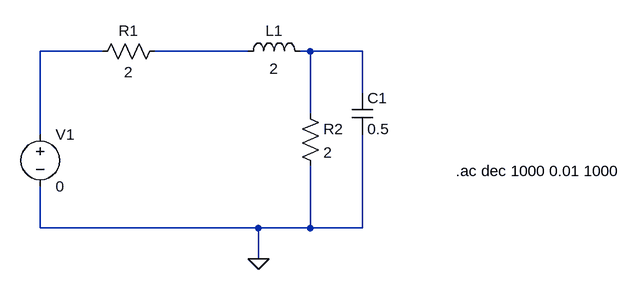
[diagram p0: schematic Part 3- AC Analysis.asc]
Part 3- AC Analysis.asc, the LTspice schematic file:
Version 4
SHEET 1 880 680
WIRE 48 176 -48 176
WIRE 272 176 128 176
WIRE 368 176 352 176
WIRE 448 176 368 176
WIRE 448 240 448 176
WIRE 368 272 368 176
WIRE -48 304 -48 176
WIRE -48 448 -48 384
WIRE 288 448 -48 448
WIRE 368 448 368 352
WIRE 368 448 288 448
WIRE 448 448 448 304
WIRE 448 448 368 448
WIRE 288 496 288 448
FLAG 288 496 0
SYMBOL voltage -48 288 R0
SYMATTR InstName V1
SYMATTR Value 0
SYMATTR Value2 AC 1 0
SYMBOL res 144 160 R90
WINDOW 0 0 56 VBottom 2
WINDOW 3 32 56 VTop 2
SYMATTR InstName R1
SYMATTR Value 2
SYMBOL ind 256 192 R270
WINDOW 0 32 56 VTop 2
WINDOW 3 5 56 VBottom 2
SYMATTR InstName L1
SYMATTR Value 2
SYMBOL cap 432 240 R0
SYMATTR InstName C1
SYMATTR Value 0.5
SYMBOL res 352 256 R0
SYMATTR InstName R2
SYMATTR Value 2
TEXT 592 360 Left 2 !.ac dec 1000 0.01 1000

The netlist it stands for:
* Part 3- AC Analysis.asc
V1 N001 0 0 AC 1 0
R1 N002 N001 2
L1 N002 N003 2
C1 N003 0 0.5
R2 N003 0 2
.ac dec 1000 0.01 1000
.backanno
.end